# Altium schematic sheet rgb.SchDoc: Test
size A4; DrawnBy: Łukasz Przeniosło; Organization: Apptimia sp. z o.o.; Address1: Wojska Polskiego 184c/4; Address2: 71-256 Szczecin; Address3: www.apptimia.com; DocumentNumber: 11; Revision: 1; SheetNumber: 11; SheetTotal: 12
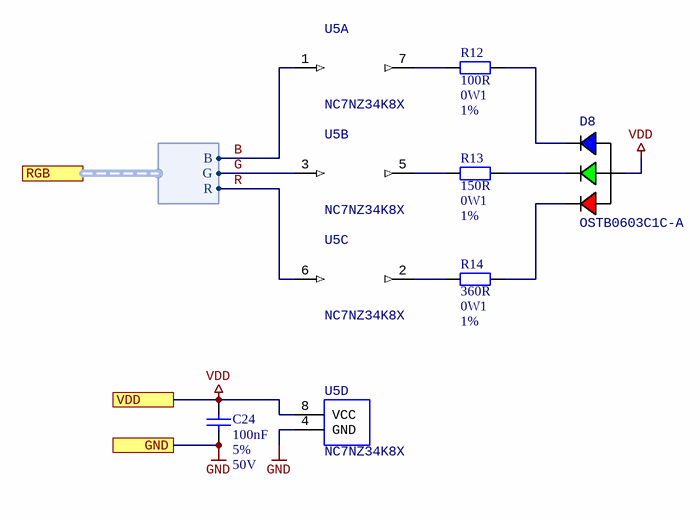
[diagram p0: rgb.SchDoc]

## Parts
C24  100nF  Tolerance: 5%  Voltage: 50V  [CAPC1608N]
D8  OSTB0603C1C-A  [RGB-0603]
R12  100R  Power: 0W1  Tolerance: 1%  [RESC1608N]
R13  150R  Power: 0W1  Tolerance: 1%  [RESC1608N]
R14  360R  Power: 0W1  Tolerance: 1%  [RESC1608N]
U5  NC7NZ34K8X  [US8]  (parts A,B,C,D of 4)

## Ports
GND, RGB (harness RGB), VDD

## Harnesses
RGB: B, G, R

## Nets
GND: C24.2 U5.4(GND) ; port GND
VDD: C24.1 D8.1(A) U5.8(VCC) ; port VDD
B: U5.1(1A) ; port RGB.B
G: U5.3(2A) ; port RGB.G
R: U5.6(3A) ; port RGB.R
NetD8_2: D8.2(KRED) R14.1
NetD8_3: D8.3(KBLU) R12.1
NetD8_4: D8.4(KGRN) R13.1
NetR12_2: R12.2 U5.7(1Y)
NetR13_2: R13.2 U5.5(2Y)
NetR14_2: R14.2 U5.2(3Y)

## Notes on the sheet
- Title
- Size:
- Date:
- A4
- Author:
- Time:
- Sheet
- of
- File:

## Library data of the parts
C24 = Capacitor: Value: 100nF
D8 = RGB0603: manid: OSTB0603C1C-A
R12-R14 = Resistor
  R12: Value: 100R
  R13: Value: 150R
  R14: Value: 360R
U5 = NC7NZ34: Trible buffer; manid: NC7NZ34K8X